# Altium project USB_PD_Splitter.PrjPcb
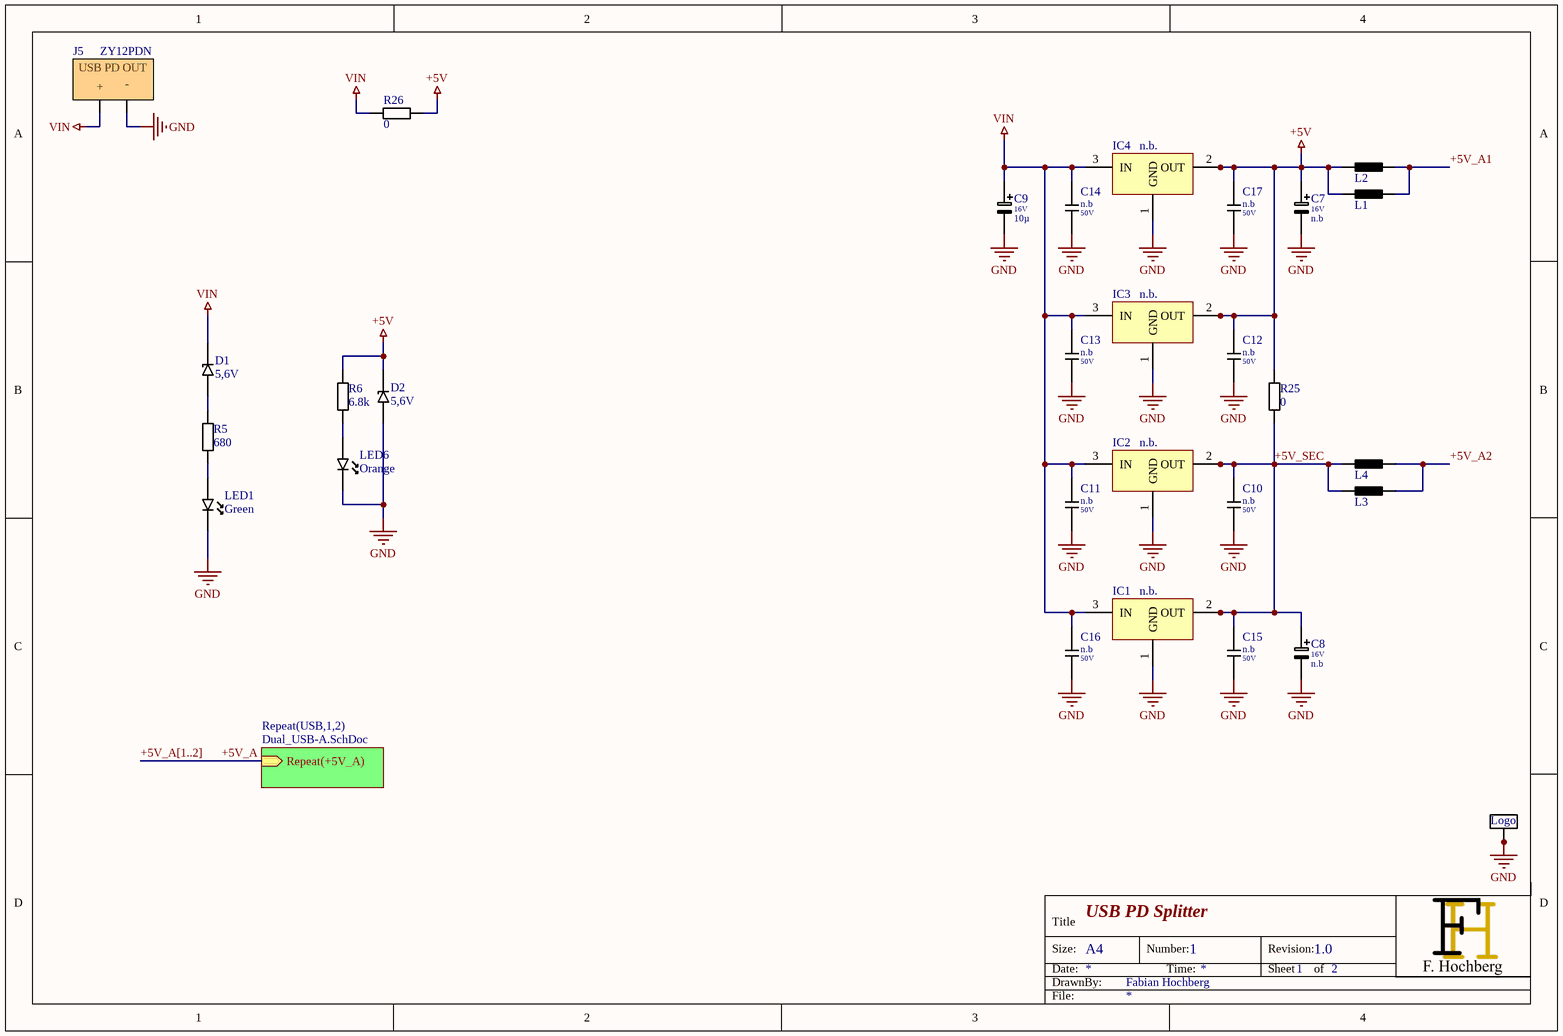
[diagram p0: Main_PDSplitter.SchDoc]
2 sheets, 109 parts. Net scope: hierarchical (ports join the sheet entries above them; power ports are global).
Board file: USB_PD_Splitter.PcbDoc
Sheets:
  Main_PDSplitter.SchDoc
    USB1 = Dual_USB-A.SchDoc
    USB2 = Dual_USB-A.SchDoc

## Sheet Main_PDSplitter.SchDoc: USB PD Splitter
size A4; DrawnBy: Fabian Hochberg; Organization: KIT; Address1: Elektrotechnisches Institut; Address2: Engelbert-Arnold-Str. 5; Address3: 76131 Karlsruhe; DocumentNumber: 1; Revision: 1.0; SheetNumber: 1; SheetTotal: 2

### Parts
C7  value n.b  Voltage: 16V  [CAPAE_4x5.4]  (hidden comment: n.b.)
C8  value n.b  Voltage: 16V  [CAPAE_4x5.4]  (hidden comment: n.b.)
C9  value 10µ  Voltage: 16V  [CAPAE_4x5.4]  (hidden comment: 10µ_16V)
C10  value n.b  Voltage: 50V  [0603_C]  (hidden comment: n.b.)
C11  value n.b  Voltage: 50V  [0603_C]  (hidden comment: n.b.)
C12  value n.b  Voltage: 50V  [0603_C]  (hidden comment: n.b.)
C13  value n.b  Voltage: 50V  [0603_C]  (hidden comment: n.b.)
C14  value n.b  Voltage: 50V  [0603_C]  (hidden comment: n.b.)
C15  value n.b  Voltage: 50V  [0603_C]  (hidden comment: n.b.)
C16  value n.b  Voltage: 50V  [0603_C]  (hidden comment: n.b.)
C17  value n.b  Voltage: 50V  [0603_C]  (hidden comment: n.b.)
D1  5,6V  [MINIMELF-SOD80]
D2  5,6V  [MINIMELF-SOD80]
IC1  n.b.  [SOT223]
IC2  n.b.  [SOT223]
IC3  n.b.  [SOT223]
IC4  n.b.  [SOT223]
J5  ZY12PDN  [ZY12PDN_BRPCB]
L1  100 Ohm @ 100MHz  [0603_L]  (value not drawn)
L2  100 Ohm @ 100MHz  [0603_L]  (value not drawn)
L3  100 Ohm @ 100MHz  [0603_L]  (value not drawn)
L4  100 Ohm @ 100MHz  [0603_L]  (value not drawn)
LED1  Green  [0603_LED]
LED6  Orange  [0603_LED]
Logo_FH1  Logo  [Logo FH]  (value not drawn)
R5  680  [0603_R]
R6  6.8k  [0603_R]
R25  0  [0603_R]
R26  0  [0603_R]

### Sub-sheets
Repeat(USB,1,2) = Dual_USB-A.SchDoc: Repeat(+5V_A) (in)

### Nets
+5V: C7.1 C12.1 C17.1 D2.2(K) IC3.2(OUT) IC3.4(OUT) IC4.2(OUT) IC4.4(OUT) L1.1 L2.1 R6.2 R25.1 R26.1
GND: C7.2 C8.2 C9.2 C10.2 C11.2 C12.2 C13.2 C14.2 C15.2 C16.2 C17.2 D2.1(A) IC1.1(GND) IC2.1(GND) IC3.1(GND) IC4.1(GND) J5.2(-) LED1.1(K) LED6.1(K) Logo_FH1.1 Logo_FH1.2 Logo_FH1.3 Logo_FH1.4
VIN: C9.1 C11.1 C13.1 C14.1 C16.1 D1.2(K) IC1.3(IN) IC2.3(IN) IC3.3(IN) IC4.3(IN) J5.1(+) R26.2
+5V_A: sheet Repeat(USB,1,2)/Repeat(+5V_A)
+5V_A1: L1.2 L2.2
+5V_A2: L3.2 L4.2
+5V_SEC: C8.1 C10.1 C15.1 IC1.2(OUT) IC1.4(OUT) IC2.2(OUT) IC2.4(OUT) L3.1 L4.1 R25.2
NetD1_1: D1.1(A) R5.2
NetLED1_2: LED1.2(A) R5.1
NetLED6_2: LED6.2(A) R6.1

### Buses and harness runs
bus +5V_A[1..2]

### Notes on the sheet
- Title
- Size:
- Date:
- DrawnBy:
- A4
- Number:
- Time:
- Revision:
- Sheet
- of
- File:
- (in symbol ZY12PDN) USB PD OUT

### Library data of the parts
C7-C9 = C POL: Elko
C10 C12 C15 C17 = C: Keramikkondensator
C11 C13 C14 C16 = C: Keramikkondensator; Designation: 0603 0.1 uF 16 V ±10% Tolerance X7R SMT Multilayer Ceramic Capacitor
D1 D2 = Zener Diode: Voltage: 5,6V
IC1-IC4 = LD1117AG: Fixedvoltage LDO, Pinassignment A; Voltage: 5V; Designation: Low Dropout Regulators 5V; Id: *
L1-L4 = L: 0,15 Ohm 1A max / 100 Ohm @ 100MHz; EBS_Nummer: 10111; HelpURL: https://ebs.eti.kit.edu/Artikel/Detailansicht/10111
LED1 LED6 = LED
  LED1: Color: Green
  LED6: Color: Orange
Logo_FH1 = Logo: 8x8 mm Logo Fabian Hochberg
R5 R6 R25 R26 = R
  R5: Value: 680
  R6: Value: 6.8k
  R25 R26: Value: 0

## Sheet Dual_USB-A.SchDoc: Dual USB A
size A4; DrawnBy: Fabian Hochberg; Organization: KIT; Address1: Elektrotechnisches Institut; Address2: Engelbert-Arnold-Str. 5; Address3: 76131 Karlsruhe; DocumentNumber: 2; Revision: 1.0; SheetNumber: 2; SheetTotal: 2
Used 2 times, as channels USB1, USB2. Parts and nets are listed once, with the designators drawn on the sheet.
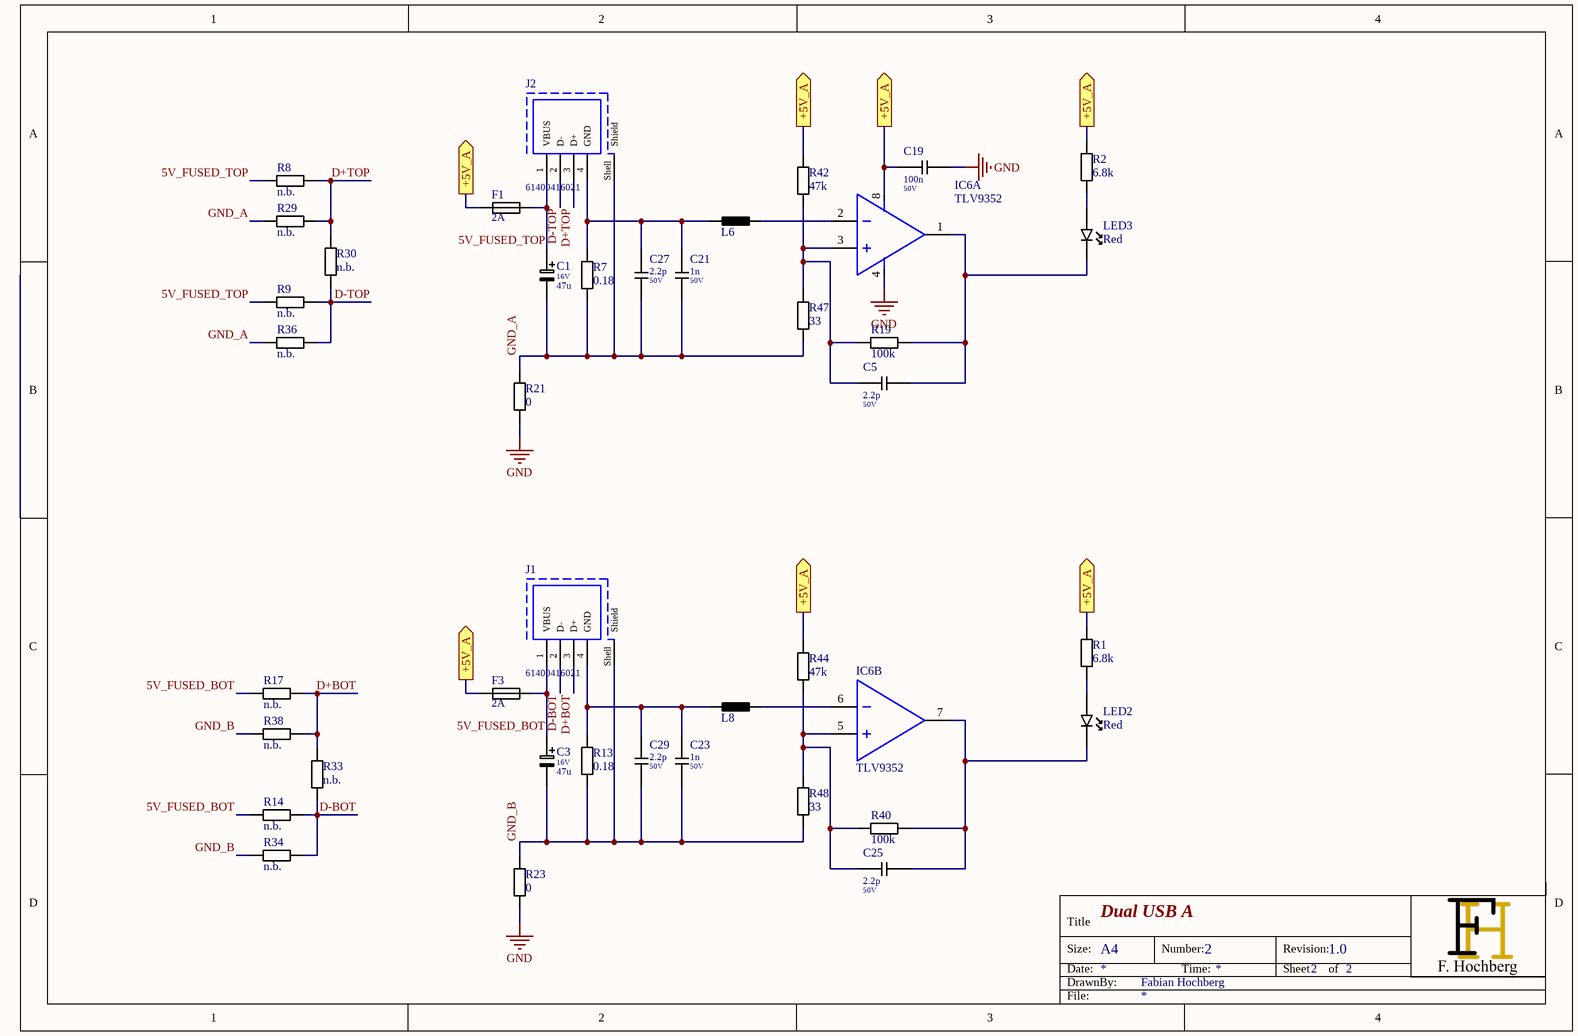
[diagram p1: Dual_USB-A.SchDoc]

### Parts
C1  value 47u  Voltage: 16V  [CAPAE_5x5.4]  (hidden comment: 47u_16V)
C3  value 47u  Voltage: 16V  [CAPAE_5x5.4]  (hidden comment: 47u_16V)
C5  value 2.2p  Voltage: 50V  [0603_C]  (hidden comment: 2.2p_50V)
C19  value 100n  Voltage: 50V  [0603_C]  (hidden comment: 100n_50V)
C21  value 1n  Voltage: 50V  [0603_C]  (hidden comment: 1n_50V)
C23  value 1n  Voltage: 50V  [0603_C]  (hidden comment: 1n_50V)
C25  value 2.2p  Voltage: 50V  [0603_C]  (hidden comment: 2.2p_50V)
C27  value 2.2p  Voltage: 50V  [0603_C]  (hidden comment: 2.2p_50V)
C29  value 2.2p  Voltage: 50V  [0603_C]  (hidden comment: 2.2p_50V)
F1  2A  [0603_Fuse]
F3  2A  [0603_Fuse]
IC6  TLV9352  [SOT23-8]  (parts A,B of 2)
J1  61400416021  [61400416021]
J2  61400416021  [61400416021]
L6  100 Ohm @ 100MHz  [0603_L]  (value not drawn)
L8  100 Ohm @ 100MHz  [0603_L]  (value not drawn)
LED2  Red  [0603_LED]
LED3  Red  [0603_LED]
R1  6.8k  [0603_R]
R2  6.8k  [0603_R]
R7  0.18  [2512_R]
R8  n.b.  [0603_R]
R9  n.b.  [0603_R]
R13  0.18  [2512_R]
R14  n.b.  [0603_R]
R17  n.b.  [0603_R]
R19  100k  [0603_R]
R21  0  [0603_R]
R23  0  [0603_R]
R29  n.b.  [0603_R]
R30  n.b.  [0603_R]
R33  n.b.  [0603_R]
R34  n.b.  [0603_R]
R36  n.b.  [0603_R]
R38  n.b.  [0603_R]
R40  100k  [0603_R]
R42  47k  [0603_R]
R44  47k  [0603_R]
R47  33  [0603_R]
R48  33  [0603_R]

### Ports
+5V_A (out)

### Nets
GND: C19.1 IC6.4(GND) R21.2 R23.2
5V_FUSED_BOT: C3.1 F3.1 J1.1(VBUS) R14.2 R17.2
5V_FUSED_TOP: C1.1 F1.1 J2.1(VBUS) R8.2 R9.2
+5V_A: C19.2 F1.2 F3.2 IC6.8(V15) R1.2 R2.2 R42.2 R44.2 ; port +5V_A
D+BOT: J1.3(D+) R17.1 R33.1 R38.1
D+TOP: J2.3(D+) R8.1 R29.1 R30.1
D-BOT: J1.2(D-) R14.1 R33.2 R34.1
D-TOP: J2.2(D-) R9.1 R30.2 R36.1
GND_A: C1.2 C21.2 C27.2 J2.Shell(Shield) R7.1 R21.1 R29.2 R36.2 R47.1
GND_B: C3.2 C23.2 C29.2 J1.Shell(Shield) R13.1 R23.1 R34.2 R38.2 R48.1
NetC5_1: C5.1 IC6.1 LED3.1(K) R19.2
NetC5_2: C5.2 IC6.3 R19.1 R42.1 R47.2
NetC21_1: C21.1 C27.1 J2.4(GND) L6.1 R7.2
NetC23_1: C23.1 C29.1 J1.4(GND) L8.1 R13.2
NetC25_1: C25.1 IC6.7 LED2.1(K) R40.2
NetC25_2: C25.2 IC6.5 R40.1 R44.1 R48.2
NetIC6_2: IC6.2 L6.2
NetIC6_6: IC6.6 L8.2
NetLED2_2: LED2.2(A) R1.1
NetLED3_2: LED3.2(A) R2.1

### Channels
USB1: designators C1=C103A C3=C107A C5=C104A C19=C100A C21=C102A C23=C106A C25=C108A C27=C101A C29=C105A F1=F100A F3=F101A IC6=IC100A J1=J101A J2=J100A L6=L100A L8=L101A LED2=LED101A LED3=LED100A R1=R106A R2=R100A R7=R102A R8=R8A R9=R9A R13=R108A R14=R14A R17=R17A R19=R104A R21=R105A R23=R111A R29=R29A R30=R30A R33=R33A R34=R34A R36=R36A R38=R38A R40=R110A R42=R101A R44=R107A R47=R103A R48=R109A; ports +5V_A=+5V_A1
USB2: designators C1=C103B C3=C107B C5=C104B C19=C100B C21=C102B C23=C106B C25=C108B C27=C101B C29=C105B F1=F100B F3=F101B IC6=IC100B J1=J101B J2=J100B L6=L100B L8=L101B LED2=LED101B LED3=LED100B R1=R106B R2=R100B R7=R102B R8=R8B R9=R9B R13=R108B R14=R14B R17=R17B R19=R104B R21=R105B R23=R111B R29=R29B R30=R30B R33=R33B R34=R34B R36=R36B R38=R38B R40=R110B R42=R101B R44=R107B R47=R103B R48=R109B; ports +5V_A=+5V_A2

### Notes on the sheet
- Title
- Size:
- Date:
- DrawnBy:
- A4
- Number:
- Time:
- Revision:
- Sheet
- of
- File:

### Library data of the parts
C1 C3 = C POL: Elko
C5 C19 C21 C23 C25 C27 C29 = C: Keramikkondensator
F1 F3 = Fuse: Value: 2A
IC6 = Dual OP Amp: OP / Comparator
J1 J2 = CMP-1502-03227-1: USB 2.0 Type A Receptacle WR-COM, Horizontal, THT; Manufacturer: Wurth Elektronik; Working Voltage: 30VAC; Rated Current: 1.5A; Contact Resistance: 20mOhm; OutsideAllowed: Yes; Manufacturer URL: http://www.we-online.de; Publisher: WurthElektronik; Packaging: Tray; Operating Temperature: -40to105degC; Orientation: Horizontal; Mounting Technology: THT; Part Number: 61400416021; Gender: Receptacle; Package Reference: 61400416021; Connector Type: USB2.0TypeA; Datasheet URL: https://katalog.we-online.de/em/datasheet/61400416021.pdf
L6 L8 = L: as L1 on sheet Main_PDSplitter; HelpURL: https://ebs.eti.kit.edu/Artikel/Detailansicht/10111
LED2 LED3 = LED: Color: Red
R1 R2 R7-R9 R13 R14 R17 R19 R21 R23 R29 R30 R33 R34 R36 R38 R40 R42 R44 R47 R48 = R
  R1 R2: Value: 6.8k
  R7 R13: Value: 0.18
  R8 R9 R14 R17 R29 R30 R33 R34 R36 R38: Value: n.b.
  R19 R40: Value: 100k
  R21 R23: Value: 0
  R42 R44: Value: 47k
  R47 R48: Value: 33

## Nets that join several sheets
GND: Main_PDSplitter (23 pins), USB1 (C100A.1 IC100A.4 R105A.2 R111A.2), USB2 (C100B.1 IC100B.4 R105B.2 R111B.2)
+5V_A1: Main_PDSplitter (L1.2 L2.2), USB1 (8 pins)
+5V_A2: Main_PDSplitter (L3.2 L4.2), USB2 (8 pins)